# Altium project 15W_FlyBack_Converter.PrjPcb
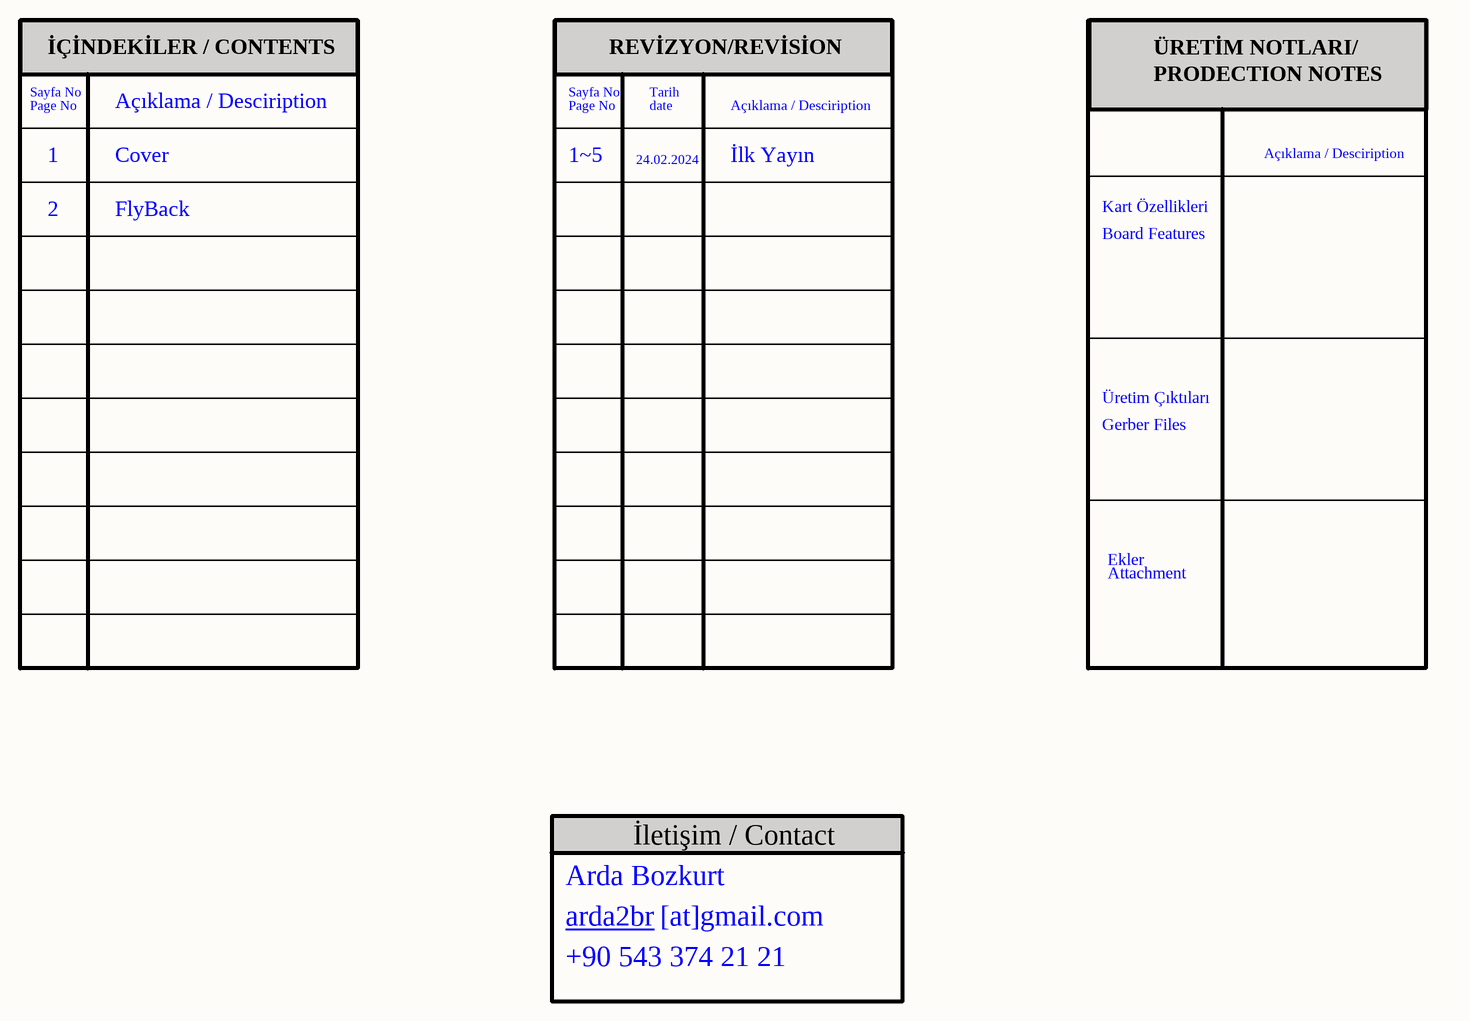
[diagram p0: Cover_Page.SchDoc]
2 sheets, 49 parts. Net scope: global (net labels, ports and power ports of the same name join across sheets).
Board file: 15WFlyBack.PcbDoc
Sheets:
  Cover_Page.SchDoc
  FlyBack.SchDoc

## Sheet Cover_Page.SchDoc
size 420 x 297 mm; Date: 24.02.2024; ApprovedBy: Arda B.; CheckedBy: Arda B.; CompanyName: -; DrawnBy: Arda Bozkurt; Revision: 001; SheetNumber: 1; SheetTotal: 2; Department: HDD; Size: A3

### Notes on the sheet
- İÇİNDEKİLER / CONTENTS
- REVİZYON/REVİSİON
- ÜRETİM NOTLARI/
- PRODECTION NOTES
- Page No
- Sayfa No
- Açıklama / Desciription
- date
- Tarih
- 1
- 2
- Cover
- FlyBack
- 1~5
- 24.02.2024
- İlk Yayın
- Kart Özellikleri
- Board Features
- Üretim Çıktıları
- Gerber Files
- Ekler
- Attachment
- Arda Bozkurt
- İletişim / Contact
- arda2br
- +90 543 374 21 21
- [at]gmail.com
- REVİSİON
- DESCRIPTION
- DATE
- APPROVED
- DWG NO:
- TAINIM/DESCRIPTION
- REV:
- DOSYA ADI/FİLE NAME
- HAZIRLAYAN/PREPARED BY
- KONTROL EDEN/ CHECKED BY
- YAYIN TARİHİ/REL. DATE
- DEĞ TARİHİ/CHANCE DATE
- ONAYLAYAN/APPROVED BY
- REVİZYON/REVISION
- BÖLÜM/DEPARTMENT
- BOYUT/SİZE
- SAYFA/SHEET
- of

## Sheet FlyBack.SchDoc
size 420 x 297 mm; Date: 24.02.2024; ApprovedBy: Arda B.; CheckedBy: Arda B.; DrawnBy: Arda Bozkrt; Revision: 001; SheetNumber: 2; SheetTotal: 2; Size: A3; Department: HDD; Time: 24.02.2024
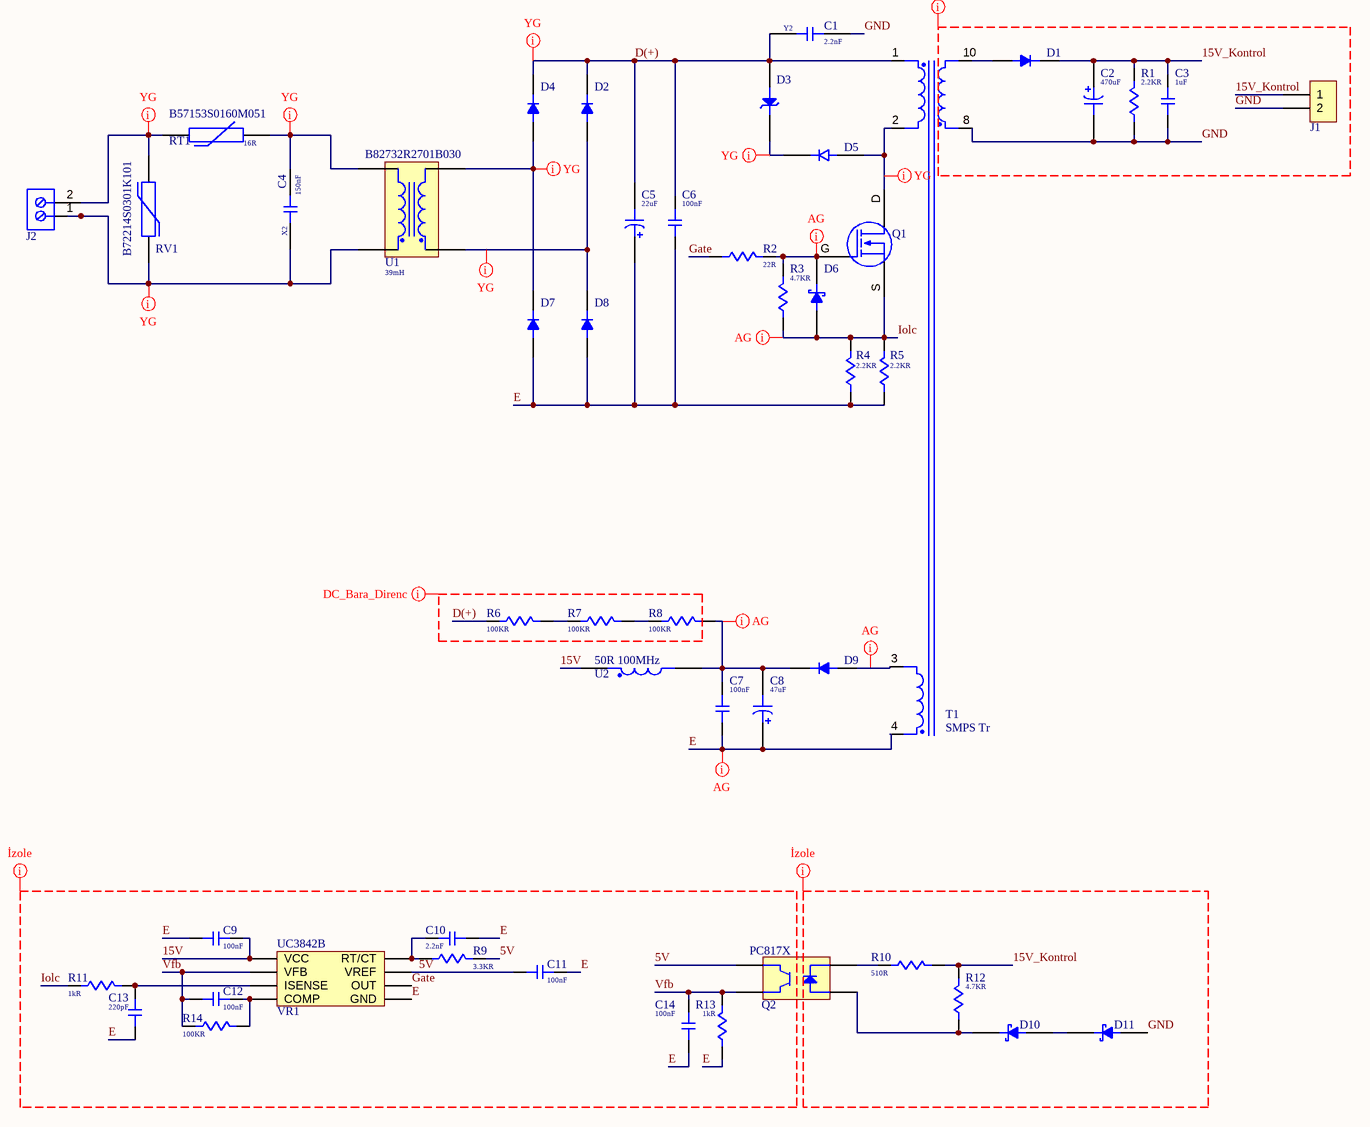
[diagram p1: FlyBack.SchDoc]

### Parts
C1  value 2.2nF  Parameter 1: Y2  [Y2-CAP]  (hidden comment: 495-4967-1-ND)
C2  value 470uF  [CAPPRD500W60D1025H1750]  (hidden comment: 860040475008)
C3  value 1uF  [CAP-0805]  (hidden comment: CL21B105KBFNNNE)
C4  value 150nF  Parameter 1: X2  [X2-CAP]  (hidden comment: MPX154K305E)
C5  value 22uF  [22uF 400V]  (hidden comment: C 22uF 400 270mArms)
C6  value 100nF  [CAP-1812]  (hidden comment: C1812C104KDRAC7800)
C7  value 100nF  [CAP-0603]  (hidden comment: CC0603KRX7R8BB104)
C8  value 47uF  [CAPPRD200W50D525H1250]  (hidden comment: 1189-1590-1-ND)
C9  value 100nF  [CAP-0603]  (hidden comment: CC0603KRX7R8BB104)
C10  value 2.2nF  [CAP-0603]  (hidden comment: KGM15AR71E222JT)
C11  value 100nF  [CAP-0603]  (hidden comment: CC0603KRX7R8BB104)
C12  value 100nF  [CAP-0603]  (hidden comment: CC0603KRX7R8BB104)
C13  value 220pF  [CAP-0603]  (hidden comment: KGM15ACG1E221JT)
C14  value 100nF  [CAP-0603]  (hidden comment: CC0603KRX7R8BB104)
D1  MUR460RLG  [DO-201AD-TO]  (value not drawn)
D2  1N4007FLTR  [DO-214AAC(SMB)]  (value not drawn)
D3  P6KE200  [TO-P6KE]  (value not drawn)
D4  1N4007FLTR  [DO-214AAC(SMB)]  (value not drawn)
D5  US1M  [DO-214AAC(SMB)]  (value not drawn)
D6  ZENER  [SOD-123]  (value not drawn)
D7  1N4007FLTR  [DO-214AAC(SMB)]  (value not drawn)
D8  1N4007FLTR  [DO-214AAC(SMB)]  (value not drawn)
D9  ES2D  [DO-214AAC(SMB)]  (value not drawn)
D10  ZENER  [SOD-123]  (value not drawn)
D11  ZENER  [SOD-123]  (value not drawn)
J1  691210910002  [CONN-TENMİNAL-BLOCK-DC]  (value not drawn)
J2  691214410002  [CONN-TERMİNAL-BLOCK-AC]  (value not drawn)
Q1  NTD360N80S3Z  [TO-252-MOSFET]  (value not drawn)
Q2  PC817X  [PC817-SMD]
R1  value 2.2KR  [RES-1206]  (hidden comment: RMCF1206JT2K20)
R2  value 22R  [RES-1206]  (hidden comment: RMCF1206JT22R0)
R3  value 4.7KR  [RES-1206]  (hidden comment: RC1206JR-074K7L)
R4  value 2.2KR  [RES-1206]  (hidden comment: RMCF1206JT2K20)
R5  value 2.2KR  [RES-1206]  (hidden comment: RMCF1206JT2K20)
R6  value 100KR  [RES-1206]  (hidden comment: RC1206JR-07100KL)
R7  value 100KR  [RES-1206]  (hidden comment: RC1206JR-07100KL)
R8  value 100KR  [RES-1206]  (hidden comment: RC1206JR-07100KL)
R9  value 3.3KR  [RES-1206]  (hidden comment: RC1206JR-073K3L)
R10  value 510R  [RES-1206]  (hidden comment: RMCF1206JT510R)
R11  value 1kR  [RES-0603]  (hidden comment: ESR03EZPJ102)
R12  value 4.7KR  [RES-1206]  (hidden comment: RC1206JR-074K7L)
R13  value 1kR  [RES-0603]  (hidden comment: ESR03EZPJ102)
R14  value 100KR  [RES-1206]  (hidden comment: RC1206JR-07100KL)
RT1  B57153S0160M051  value 16R  [NTC-TO]
RV1  B72214S0301K101  [VARİSTOR]
T1  SMPS Tr  [SMPS-TR3]
U1  B82732R2701B030  value 39mH  [CMC]
U2  50R 100MHz  [BEAD-1206]
VR1  UC3842B  [SOP-8-UC]

### Nets
5V: C11.1 Q2.3 R9.2 VR1.8(VREF)
15V: C9.2 U2.1 VR1.7(VCC)
15V_Kontrol: C2.2 C3.2 D1.2 J1.1 R1.2 R10.2 R12.2
D(+): C1.1 C5.1 C6.2 D2.2 D3.1 D4.2 R6.1 T1.1
E: C5.2 C6.1 C7.1 C8.2 C9.1 C10.2 C11.2 C13.1 C14.1 D7.1 D8.1 R4.1 R5.1 R13.1 T1.4 VR1.5(GND)
Gate: R2.1 VR1.6(OUT)
GND: C1.2 C2.1 C3.1 D11.1 J1.2 R1.1 T1.8
Iolc: D6.1 Q1.S R3.1 R4.2 R5.2 R11.1
Vfb: C12.1 C14.2 Q2.4 R13.2 R14.1 VR1.2(VFB)
NetC4_1: C4.1 J2.1 RV1.1 U1.2
NetC4_2: C4.2 RT1.2 U1.1
NetC7_2: C7.2 C8.1 D9.2 R8.2 U2.2
NetC10_1: C10.1 R9.1 VR1.4(RT/CT)
NetC12_2: C12.2 R14.2 VR1.1(COMP)
NetC13_2: C13.2 R11.2 VR1.3(ISENSE)
NetD1_1: D1.1 T1.10
NetD2_1: D2.1 D8.2 U1.3
NetD3_2: D3.2 D5.2
NetD4_1: D4.1 D7.2 U1.4
NetD5_1: D5.1 Q1.D T1.2
NetD6_2: D6.2 Q1.G R2.2 R3.2
NetD9_1: D9.1 T1.3
NetD10_1: D10.1 D11.2
NetD10_2: D10.2 Q2.1 R12.1
NetJ2_2: J2.2 RT1.1 RV1.2
NetQ2_2: Q2.2 R10.1
NetR6_2: R6.2 R7.1
NetR7_2: R7.2 R8.1

### Layout directives
net class AG: E, Iolc, NetC7_2, NetD6_2, NetD9_1
net class İzole: 5V, 15V, 15V_Kontrol, E, Gate, GND, Iolc, Vfb
net class DC_Bara_Direnc: D(+)
net class YG: D(+), NetC4_1, NetC4_2, NetD2_1, NetD3_2, NetD4_1, NetD5_1, NetJ2_2

### Notes on the sheet
- REVİSİON
- DESCRIPTION
- DATE
- APPROVED
- DWG NO:
- TAINIM/DESCRIPTION
- REV:
- DOSYA ADI/FİLE NAME
- HAZIRLAYAN/PREPARED BY
- KONTROL EDEN/ CHECKED BY
- YAYIN TARİHİ/REL. DATE
- DEĞ TARİHİ/CHANCE DATE
- ONAYLAYAN/APPROVED BY
- REVİZYON/REVISION
- Arda Bozkurt
- BÖLÜM/DEPARTMENT
- BOYUT/SİZE
- SAYFA/SHEET
- of

### Library data of the parts
C1 = Cap Y2 2.2nF 300V MKP TDK: Film Capacitor, Polypropylene, 1500V, 20% +Tol, 20% -Tol, 0.0022uF, Through Hole Mount; Manufacturer: TDK EPCOS; Manufacturer Part Number: B32021A3222M189; Supplier: Farnell; Supplier Part Number: 2525309; RoHS: Yes; Category: Film Capacitors; Stock: 6753; Pricing: 1=0,423, 50=0,366, 100=0,309, 250=0,282, 500=0,255 (EUR); Lead Free: 5697LeadFree; ComponentLink1URL: https://datasheet.ciiva.com/26855/getdatasheetpartid-407539-26855093.pdf?src-supplier=Verical; ComponentLink1Description: https://datasheet.ciiva.com/26855/getdatasheetpartid-407539-26855093.pdf?src-supplier=Verical; ComponentLink2URL: https://datasheet.ciiva.com/7614/y2-b32021-026-7614902.pdf?src-supplier=Digikey; ComponentLink2Description: https://datasheet.ciiva.com/7614/y2-b32021-026-7614902.pdf?src-supplier=Digikey
C2 = CAP 470uF 35V 1.76A 28mOhm: WCAP-ATUL Aluminum Electrolytic Capacitors; Manufacturer: Wurth Electronics; Supplier: Farnell; Supplier Part Number: 2495092; Manufacturer Part Number: 860040475008; RoHS: Yes; Category: Aluminum Electrolytic Capacitors; Stock: 471; Pricing: 1=0,614, 10=0,591, 50=0,456, 100=0,397, 200=0,353, 500=0,309, 2500=0,303, 5000=0,297 (EUR); ComponentLink1URL: http://www.farnell.com/datasheets/1958393.pdf?src-supplier=Farnell; ComponentLink1Description: http://www.farnell.com/datasheets/1958393.pdf?src-supplier=Farnell; ComponentLink2URL: http://www.produktinfo.conrad.com/datenblaetter/1200000-1299999/001281119-da-01-en-WCAP_ATUL_ALU_ELEC_CAPS_860040475008.pdf?src-supplier=Conrad; ComponentLink2Description: http://www.produktinfo.conrad.com/datenblaetter/1200000-1299999/001281119-da-01-en-WCAP_ATUL_ALU_ELEC_CAPS_860040475008.pdf?src-supplier=Conrad; ComponentLink3URL: http://katalog.we-online.de/pbs/datasheet/860040475008.pdf?src-supplier=Digikey; ComponentLink3Description: http://katalog.we-online.de/pbs/datasheet/860040475008.pdf?src-supplier=Digikey; ComponentLink4URL: https://katalog.we-online.de/pbs/datasheet/860040475008.pdf?src-supplier=Digikey; ComponentLink4Description: https://katalog.we-online.de/pbs/datasheet/860040475008.pdf?src-supplier=Digikey; ComponentLink5URL: http://www.farnell.com/datasheets/1958393.pdf?src-supplier=Element14; ComponentLink5Description: http://www.farnell.com/datasheets/1958393.pdf?src-supplier=Element14
C3 = C-CER 1uF 50V X7R 0805: Multilayer Ceramic Capacitor, 1 uF, 50 V, ± 10%, X7R, 0805 [2012 Metric]; Manufacturer: Samsung; Voltage Rating: 50V; Supplier: Farnell; Supplier Part Number: 3013482; Manufacturer Part Number: CL21B105KBFNNNE; RoHS: Yes; Category: Ceramic Capacitors; Stock: 143392; Pricing: 5=0,063, 50=0,038, 250=0,032, 500=0,027, 1000=0,021 (EUR); Mounting Technology: Surface Mount; Case/Package: 0805; Material: Ceramic; Case Code (Metric): 2012; Case Code (Imperial): 0805; Min Operating Temperature: -55°C; Max Operating Temperature: 125°C; Tolerance: 10%; Packaging: Tape and Reel; Package Quantity: 1; Dielectric: X7R; Voltage: 50V; Series: CL; Construction: Flat; Voltage Rating (DC): 50V; Length: 2mm; Width: 0.049inch; Height: 1.25mm; Thickness: 0.053inch; Depth: 1.25mm; Radiation Hardening: No; RoHS Compliant: Yes; ComponentLink1URL: https://datasheet.ciiva.com/25800/cl21b105kbfnnne-25800291.pdf?src-supplier=Digikey; ComponentLink1Description: https://datasheet.ciiva.com/25800/cl21b105kbfnnne-25800291.pdf?src-supplier=Digikey
C4 = CAP 150nF 305VAC X2: MPX Boxed Metalized Propylene X2 Class Interference Suppressor Film Capacitors; Manufacturer: Cornell Dubilier; Supplier: Mouser; Supplier Part Number: 598-MPX154K305E; Manufacturer Part Number: MPX154K305E; RoHS: No; Stock: 2208; Pricing: 1=0,55, 10=0,366, 50=0,366, 100=0,241, 1000=0,159, 10000=0,129 (USD); ComponentLink1URL: http://www.illinoiscapacitor.com/pdf/seriesDocuments/MPX%20series.pdf?src-supplier=Digikey; ComponentLink1Description: http://www.illinoiscapacitor.com/pdf/seriesDocuments/MPX%20series.pdf?src-supplier=Digikey
C5 = CAP 22uF 400V 270mArms: Cap Aluminum Lytic 22uF 400V 20%( 12.5 X 16mm) Radial 5mm 180mA 2000h 105C; Manufacturer: Rubycon; Manufacturer Part Number: 400AX22MEFC12.5X16; Supplier: Mouser; Supplier Part Number: 232-400AX22MEFC125X1; RoHS: Yes; Category: Aluminum Electrolytic Capacitors; Stock: 1061; Pricing: 1=1,01, 10=0,638, 50=0,638, 100=0,52, 1000=0,366, 10000=0,336 (USD); Mounting Technology: Through Hole; Case/Package: Radial; Min Operating Temperature: -40°C; Max Operating Temperature: 105°C; Voltage Rating: 400V; Tolerance: 20%; Series: AX; RoHS Compliant: Yes; ComponentLink1URL: http://www.rubycon.co.jp/en/catalog/e_pdfs/aluminum/Radial_Lead_Alumi_Eng.pdf?src-supplier=Digikey; ComponentLink1Description: http://www.rubycon.co.jp/en/catalog/e_pdfs/aluminum/Radial_Lead_Alumi_Eng.pdf?src-supplier=Digikey
C6 = C-CER 100nF 1KV X7R 1812: Multilayer Ceramic Capacitor, 0.1 uF, 1000 V, ± 10%, X7R, 1812 [4532 Metric]; Manufacturer: KEMET; Manufacturer Part Number: C1812C104KDRACTU; Material: 4241ConductorMaterial; Voltage Rating: 1kV; Supplier: Mouser; Supplier Part Number: 80-C1812C104KDRACTU; RoHS: Yes; Category: Ceramic Capacitors; Stock: 11645; Pricing: 1=0,71, 10=0,47, 50=0,47, 100=0,354, 1000=0,294, 10000=0,282 (USD); Mounting Technology: Surface Mount; Case/Package: 1812; Case Code (Imperial): 1812; Case Code (Metric): 4532; Dielectric Material: 4241ConductorMaterial; Min Operating Temperature: -55°C; Max Operating Temperature: 125°C; Packaging: Tape and Reel; Voltage Rating (DC): 1kV; Package Quantity: 1; Series: C; Tolerance: 10%; Dielectric: X7R; Termination: SMD/SMT; Length: 0.177inch; Width: 0.126inch; Height: 1.85mm; Thickness: 0.073inch; RoHS Compliant: Yes; Reach SVHC Compliant: No; ComponentLink1URL: http://www.farnell.com/datasheets/2746125.pdf?src-supplier=Farnell; ComponentLink1Description: http://www.farnell.com/datasheets/2746125.pdf?src-supplier=Farnell; ComponentLink2URL: http://www.mouser.com/ds/2/212/KEM_C1010_X7R_HV_SMD-1102742.pdf?src-supplier=Mouser; ComponentLink2Description: http://www.mouser.com/ds/2/212/KEM_C1010_X7R_HV_SMD-1102742.pdf?src-supplier=Mouser; ComponentLink3URL: https://datasheet.octopart.com/C1812C104KDRACTU-Kemet-datasheet-65933459.pdf?src-supplier=Element14; ComponentLink3Description: https://datasheet.octopart.com/C1812C104KDRACTU-Kemet-datasheet-65933459.pdf?src-supplier=Element14; ComponentLink4URL: https://datasheet.octopart.com/C1812C104KDRACTU-KEMET-datasheet-103257394.pdf?src-supplier=Farnell; ComponentLink4Description: https://datasheet.octopart.com/C1812C104KDRACTU-KEMET-datasheet-103257394.pdf?src-supplier=Farnell; ComponentLink5URL: https://datasheet.octopart.com/C1812C104KDRACTU-KEMET-datasheet-83562145.pdf?src-supplier=Newark; ComponentLink5Description: https://datasheet.octopart.com/C1812C104KDRACTU-KEMET-datasheet-83562145.pdf?src-supplier=Newark; ComponentLink6URL: https://api.kemet.com/component-edge/download/specsheet/C1812C104KDRAC7800.pdf?src-supplier=Digikey; ComponentLink6Description: https://api.kemet.com/component-edge/download/specsheet/C1812C104KDRAC7800.pdf?src-supplier=Digikey; ComponentLink7URL: https://search.kemet.com/component-edge/download/specsheet/C1812C104KDRAC7800.pdf?src-supplier=Digikey; ComponentLink7Description: https://search.kemet.com/component-edge/download/specsheet/C1812C104KDRAC7800.pdf?src-supplier=Digikey; ComponentLink8URL: http://www.farnell.com/datasheets/2746125.pdf?src-supplier=Newark; ComponentLink8Description: http://www.farnell.com/datasheets/2746125.pdf?src-supplier=Newark; ComponentLink9URL: https://datasheet.octopart.com/C1812C104KDRACTU-KEMET-datasheet-147336162.pdf?src-supplier=TME; ComponentLink9Description: https://datasheet.octopart.com/C1812C104KDRACTU-KEMET-datasheet-147336162.pdf?src-supplier=TME; ComponentLink10URL: https://datasheet.octopart.com/C1812C104KDRACTU-KEMET-datasheet-134136062.pdf?src-supplier=Electro+Sonic; ComponentLink10Description: https://datasheet.octopart.com/C1812C104KDRACTU-KEMET-datasheet-134136062.pdf?src-supplier=Electro+Sonic
C7 C9 C11 C12 C14 = C-CER 0.1UF 25V X7R 0603: Multilayer Ceramic Capacitor, 0.1 uF, 25 V, ± 10%, X7R, 0603 [1608 Metric]; Manufacturer: Yageo; Material: 4241ConductorMaterial; Voltage Rating: 25V; Supplier: Farnell; Supplier Part Number: 3369240; Manufacturer Part Number: CC0603KRX7R8BB104; RoHS: Yes; Category: Ceramic Capacitors; Stock: 1312755; Pricing: 10=0,026, 100=0,015, 500=0,012, 1000=0,01, 2000=0,0098 (EUR); Mounting Technology: Surface Mount; Case/Package: 0603; Pins: 2; Case Code (Imperial): 0603; Case Code (Metric): 1608; Min Operating Temperature: -55°C; Max Operating Temperature: 125°C; Tolerance: 10%; Dielectric: X7R; Packaging: Tape and Reel; Package Quantity: 1; Voltage Rating (DC): 25V; Termination: SMD/SMT; Voltage: 25V; Series: CC; Length: 1.6mm; Width: 0.031inch; Height: 0.8mm; Thickness: 0.035inch; Depth: 0.8mm; Radiation Hardening: No; RoHS Compliant: Yes; Reach SVHC Compliant: Unknown; Halogen Free: 5694HalogenFree; Lead Free: 5697LeadFree; ComponentLink1URL: https://datasheet.ciiva.com/144/mlccorderingcode-144075.pdf?src-supplier=Digikey; ComponentLink1Description: https://datasheet.ciiva.com/144/mlccorderingcode-144075.pdf?src-supplier=Digikey; ComponentLink2URL: https://datasheet.ciiva.com/11786/0900766b80c10176-11786120.pdf?src-supplier=Rs; ComponentLink2Description: https://datasheet.ciiva.com/11786/0900766b80c10176-11786120.pdf?src-supplier=Rs; ComponentLink3URL: https://datasheet.ciiva.com/13389/upy-gphc-x7r-6-3v-to-50v-8-13389352.pdf?src-supplier=Mouser; ComponentLink3Description: https://datasheet.ciiva.com/13389/upy-gphc-x7r-6-3v-to-50v-8-13389352.pdf?src-supplier=Mouser; ComponentLink4URL: https://datasheet.ciiva.com/7978/1489800-7978155.pdf?src-supplier=Element14; ComponentLink4Description: https://datasheet.ciiva.com/7978/1489800-7978155.pdf?src-supplier=Element14; ComponentLink5URL: https://datasheet.ciiva.com/28450/1489800-28450584.pdf?src-supplier=Element14; ComponentLink5Description: https://datasheet.ciiva.com/28450/1489800-28450584.pdf?src-supplier=Element14; ComponentLink6URL: https://datasheet.ciiva.com/144/mlccorderingcode-144074.pdf?src-supplier=Digikey; ComponentLink6Description: https://datasheet.ciiva.com/144/mlccorderingcode-144074.pdf?src-supplier=Digikey; ComponentLink7URL: https://datasheet.ciiva.com/144/mlccorderingcode-144073.pdf?src-supplier=Digikey; ComponentLink7Description: https://datasheet.ciiva.com/144/mlccorderingcode-144073.pdf?src-supplier=Digikey; ComponentLink8URL: https://datasheet.ciiva.com/11587/upy-gphc-x7r-6-3v-to-50v-8-11587208.pdf?src-supplier=Avnet; ComponentLink8Description: https://datasheet.ciiva.com/11587/upy-gphc-x7r-6-3v-to-50v-8-11587208.pdf?src-supplier=Avnet; ComponentLink9URL: https://datasheet.ciiva.com/26829/getdatasheetpartid-403577-26829431.pdf?src-supplier=Verical; ComponentLink9Description: https://datasheet.ciiva.com/26829/getdatasheetpartid-403577-26829431.pdf?src-supplier=Verical
C8 = CAP 47uF 25V 250mArms 400mOhm: RUBYCON         25YXJ47MTA5X11            Electrolytic Capacitor, Miniature, YXJ Series, 47 F,  20%, 25 V, 5 mm, Radial Leaded; Voltage Rating: 25V; Ripple Current: 175mA; Impedance: 400mR; Supplier: Farnell; Supplier Part Number: 2346258; Manufacturer: Rubycon; Manufacturer Part Number: 25YXJ47MTA5X11; RoHS: Yes; Category: Aluminum Electrolytic Capacitors; Stock: 3896; Pricing: 5=0,121, 50=0,079, 250=0,068, 500=0,063, 1500=0,059, 3000=0,053, 15000=0,052, 30000=0,051 (EUR); Mounting Technology: Through Hole; Case/Package: Radial; Min Operating Temperature: -40°C; Max Operating Temperature: 105°C; Tolerance: 20%; Package Quantity: 2000; Packaging: Cut Tape; Voltage Rating (DC): 25V; Features: General Purpose; Series: YXJ; Diameter: 5mm; Height: 11mm; Lead Pitch: 0.079inch; Height - Seated (Max): 0.492inch; Reach SVHC Compliant: No; RoHS Compliant: Yes; ComponentLink1URL: https://datasheet.ciiva.com/6328/e-yxj-6328843.pdf?src-supplier=Digikey; ComponentLink1Description: https://datasheet.ciiva.com/6328/e-yxj-6328843.pdf?src-supplier=Digikey; ComponentLink2URL: https://datasheet.ciiva.com/22732/1657883-22732557.pdf?src-supplier=Element14; ComponentLink2Description: https://datasheet.ciiva.com/22732/1657883-22732557.pdf?src-supplier=Element14
C10 = C-CER 2.2nF 25V X7R 0603: CAP CER 2200PF 25V X7R 0603; Manufacturer: Kyocera AVX; Supplier: Mouser; Supplier Part Number: 581-KGM15AR71E222JT; Manufacturer Part Number: KGM15AR71E222JT; RoHS: No; Stock: 15998; Pricing: 1=0,1, 10=0,039, 50=0,039, 100=0,019, 1000=0,012, 10000=0,01 (USD)
C13 = C-CER 220pF 25V C0G/NP0 0603: CAP CER 220PF 25V C0G/NP0 0603; Manufacturer: Kyocera AVX; Supplier: Digikey; Supplier Part Number: 478-KGM15ACG1E221JTCT-ND; Manufacturer Part Number: KGM15ACG1E221JT; RoHS: No; Stock: 129544; Pricing: 1=0,1, 10=0,04, 50=0,0228, 100=0,0177, 500=0,01334, 1000=0,01048 (USD)
D1 = Diyot DO-201AD Dik: VR=600V IF=4A Trr=75ns; Manufacturer: ON Semiconductor; Supplier: Arrow Electronics; Supplier Part Number: MUR460RLG; Manufacturer Part Number: MUR460RLG; RoHS: Yes; Category: Rectifier Diodes; Stock: 76500; Pricing: 1500=0,256, 3000=0,2262, 7500=0,2123, 10500=0,1948, 37500=0,191 (USD); ComponentLink1URL: https://datasheet.ciiva.com/8292/mur420-d-8292330.pdf?src-supplier=Avnet; ComponentLink1Description: https://datasheet.ciiva.com/8292/mur420-d-8292330.pdf?src-supplier=Avnet; ComponentLink2URL: https://datasheet.ciiva.com/8299/mur420-d-8299765.pdf?src-supplier=Avnet; ComponentLink2Description: https://datasheet.ciiva.com/8299/mur420-d-8299765.pdf?src-supplier=Avnet; ComponentLink3URL: https://datasheet.ciiva.com/22659/1708324-22659094.pdf?src-supplier=Element14; ComponentLink3Description: https://datasheet.ciiva.com/22659/1708324-22659094.pdf?src-supplier=Element14; ComponentLink4URL: https://datasheet.ciiva.com/916/mur420-d-916026.pdf?src-supplier=Digikey; ComponentLink4Description: https://datasheet.ciiva.com/916/mur420-d-916026.pdf?src-supplier=Digikey; ComponentLink5URL: https://datasheet.ciiva.com/916/mur420-d-916027.pdf?src-supplier=Digikey; ComponentLink5Description: https://datasheet.ciiva.com/916/mur420-d-916027.pdf?src-supplier=Digikey
D2 D4 D7 D8 = D 1N4007 DO-214AA(SMB): Standard Rectifier 1000V SOD-123; Manufacturer: SMC; Supplier: Future Electronics; Supplier Part Number: 8135663; Manufacturer Part Number: 1N4007FLTR; RoHS: No; Pricing: 3000=0,014, 12000=0,0134, 45000=0,0129, 120000=0,0125, 300000=0,0119 (USD)
D3 = TVS DO15 162V 600W UNIDIR: Diode TVS Single Bi-Directional 171V 600W 2-Pin DO-15 - Tape and Reel; Manufacturer: Taiwan Semiconductor; Manufacturer Part Number: P6KE200CA; Designed By: Arda B.; Max Breakdown Voltage: 210V; Forward Voltage: 1V; Max Forward Surge Current (Ifsm): 2.5A; Max Repetitive Reverse Voltage (Vrrm): 250V; Power Dissipation: 200mW; Reverse Recovery Time: 50ns; Supplier: Mouser; Supplier Part Number: 821-P6KE200CA; RoHS: Yes; Category: TVS Diodes; Stock: 2424; Pricing: 1=0,43, 10=0,354, 50=0,354, 100=0,222, 1000=0,14, 10000=0,109 (USD); Reach SVHC Compliant: 4186SVHC; ComponentLink1URL: http://uk.rs-online.com/webdocs/0dae/0900766b80dae633.pdf?src-supplier=Rs; ComponentLink1Description: http://uk.rs-online.com/webdocs/0dae/0900766b80dae633.pdf?src-supplier=Rs; ComponentLink2URL: http://datasheet.octopart.com/P6KE200CA-Taiwan-Semiconductor-datasheet-62315087.pdf?src-supplier=Verical; ComponentLink2Description: http://datasheet.octopart.com/P6KE200CA-Taiwan-Semiconductor-datasheet-62315087.pdf?src-supplier=Verical; ComponentLink3URL: http://datasheet.octopart.com/P6KE200CA-Taiwan-Semiconductor-datasheet-62315087.pdf?src-supplier=Digikey; ComponentLink3Description: http://datasheet.octopart.com/P6KE200CA-Taiwan-Semiconductor-datasheet-62315087.pdf?src-supplier=Digikey; ComponentLink4URL: http://datasheet.octopart.com/P6KE200CA-Taiwan-Semiconductor-datasheet-62315087.pdf?src-supplier=Mouser; ComponentLink4Description: http://datasheet.octopart.com/P6KE200CA-Taiwan-Semiconductor-datasheet-62315087.pdf?src-supplier=Mouser; ComponentLink5URL: http://datasheet.octopart.com/P6KE200CA-Taiwan-Semiconductor-datasheet-62315087.pdf?src-supplier=Arrow+Electronics; ComponentLink5Description: http://datasheet.octopart.com/P6KE200CA-Taiwan-Semiconductor-datasheet-62315087.pdf?src-supplier=Arrow+Electronics; ComponentLink6URL: http://datasheet.octopart.com/P6KE200CA-Taiwan-Semiconductor-datasheet-62315087.pdf?src-supplier=Avnet; ComponentLink6Description: http://datasheet.octopart.com/P6KE200CA-Taiwan-Semiconductor-datasheet-62315087.pdf?src-supplier=Avnet; ComponentLink7URL: http://datasheet.octopart.com/P6KE200CA-Taiwan-Semiconductor-datasheet-62315087.pdf?src-supplier=Farnell; ComponentLink7Description: http://datasheet.octopart.com/P6KE200CA-Taiwan-Semiconductor-datasheet-62315087.pdf?src-supplier=Farnell; ComponentLink8URL: http://docs-usa.electrocomponents.com/techlib:/itc_doclist_US.htm?stockno=6873857&src-supplier=Allied+Electronics; ComponentLink8Description: http://docs-usa.electrocomponents.com/techlib:/itc_doclist_US.htm?stockno=6873857&src-supplier=Allied+Electronics; ComponentLink9URL: http://datasheet.octopart.com/P6KE200CA-Taiwan-Semiconductor-datasheet-62315087.pdf?src-supplier=Rs; ComponentLink9Description: http://datasheet.octopart.com/P6KE200CA-Taiwan-Semiconductor-datasheet-62315087.pdf?src-supplier=Rs
D5 = D 1KV 1A DO214AC SMA: Diode Ultra Fast Recovery Rectifier 1K Volt 1A 2-Pin SMA Tape and Reel; Manufacturer: Diodes; Manufacturer Part Number: US1M-13-F; Designed By: Arda B.; Reverse Voltage: 1kV; Supplier: Future Electronics; Supplier Part Number: 7135234; RoHS: Yes; Category: Rectifier Diodes; Stock: 5935000; Pricing: 5000=0,0385, 15000=0,0371, 20000=0,0367, 50000=0,0356, 75000=0,0345 (USD); ComponentLink1URL: https://datasheet.ciiva.com/27052/1542696-27052440.pdf?src-supplier=Jameco; ComponentLink1Description: https://datasheet.ciiva.com/27052/1542696-27052440.pdf?src-supplier=Jameco; ComponentLink2URL: https://datasheet.ciiva.com/4454/ds16008-60440-4454096.pdf?src-supplier=Mouser; ComponentLink2Description: https://datasheet.ciiva.com/4454/ds16008-60440-4454096.pdf?src-supplier=Mouser; ComponentLink3URL: https://datasheet.ciiva.com/917/ds16008-917195.pdf?src-supplier=Digikey; ComponentLink3Description: https://datasheet.ciiva.com/917/ds16008-917195.pdf?src-supplier=Digikey; ComponentLink4URL: https://datasheet.ciiva.com/917/ds16008-917196.pdf?src-supplier=Digikey; ComponentLink4Description: https://datasheet.ciiva.com/917/ds16008-917196.pdf?src-supplier=Digikey; ComponentLink5URL: https://datasheet.ciiva.com/8301/ds16008-8301519.pdf?src-supplier=Avnet; ComponentLink5Description: https://datasheet.ciiva.com/8301/ds16008-8301519.pdf?src-supplier=Avnet; ComponentLink6URL: https://datasheet.ciiva.com/22695/1906610-22695853.pdf?src-supplier=Element14; ComponentLink6Description: https://datasheet.ciiva.com/22695/1906610-22695853.pdf?src-supplier=Element14; ComponentLink7URL: https://datasheet.ciiva.com/8303/ds16008-8303103.pdf?src-supplier=Avnet; ComponentLink7Description: https://datasheet.ciiva.com/8303/ds16008-8303103.pdf?src-supplier=Avnet
D6 D10 D11 = Zener SOD-123: SOD-123; Manufacturer: Murata; Manufacturer Part Number: GRM2165C2A822JA01D; Designed By: Arda B.; Supplier: Mouser; Supplier Part Number: 81-GRM2165C2A822JA1D; RoHS: Yes; Category: Ceramic Capacitors; Stock: 3147; Pricing: 1=0,17, 10=0,107, 50=0,107, 100=0,054, 1000=0,035, 10000=0,026 (USD)
D9 = D GEN PURP 200V 2A DO214AA: ES2DFSCT-ND; Manufacturer: Diodes; Manufacturer Part Number: ES2DA-13-F; Package Body Material: Plastic; Diode Element Material: SILICON; Forward Current: 2A; Max Reverse Current: 5uA; Max Surge Current: 50A; Forward Voltage: 920mV; Recovery Time: 25ns; Number of Elements: 1; Reverse Voltage (DC): 200V; Polarity: Standard; Natural Thermal Resistance: 20°C/W; Application(s): EFFICIENCY; Diode Type: RECTIFIER; Time @ Peak Reflow Temperature-Max (s): 5s; Diode Capacitance-Max: 25pF; Designed By: Arda B.; Value: 25pF; Supplier: Digikey; Supplier Part Number: ES2DA-FDICT-ND; RoHS: Yes; Category: Rectifier Diodes; Stock: 395285; Pricing: 1=0,49, 10=0,382, 100=0,2291, 500=0,2121, 1000=0,14423, 2000=0,13278 (USD); Mounting Technology: Surface Mount; Case/Package: SMA; Pins: 2; Weight: 0.002258oz; Package Shape: Rectangular; Terminal Finish: Tin; Min Operating Temperature: -55°C; Max Operating Temperature: 150°C; Packaging: Tape and Reel; Package Quantity: 5000; Average Rectified Current: 2A; Reverse Recovery Time: 25ns; Max Repetitive Reverse Voltage (Vrrm): 200V; Peak Non-Repetitive Surge Current: 50A; Termination: SMD/SMT; Voltage Rating (DC): 200V; Current Rating: 2A; Output Current: 2A; Max Reverse Voltage (DC): 200V; Series: -; JESD-30 Code: R-PDSO-C2; Terminal Form: C BEND; Terminal Position: DUAL; Number of Phases: 1; Surface Mount: Yes; Moisture Sensitivity Level: 1; Peak Reflow Temperature (Cel): 245°C; Reverse Recovery Time-Max: 25ns; Length: 4.6mm; Width: 2.92mm; Height: 2.1mm; Radiation Hardening: No; Lead Free: Lead Free; RoHS Compliant: Yes
J1 = TERM BLOCK 2P HORIZON 2.54MM PCB: Tb, Wire To Brd, R/A, 2Way, 18Awg Rohs Compliant: Yes |Wurth Elektronik 691210910002; Manufacturer: Wurth Electronics; Plating: Brass,Steel; Number of Positions Per Level: 2; Number of Levels: 1; Current: 6A; Voltage: 150V; Number of Contacts: 2NUMBER; Wire Gauge (Max): 30AWG; Designed By: Arda B.; Supplier: Mouser; Supplier Part Number: 710-691210910002; Manufacturer Part Number: 691210910002; RoHS: Yes; Category: Terminal Blocks; Stock: 14926; Pricing: 1=1,14, 10=1,04, 50=0,984, 100=0,905, 1000=0,748, 10000=0,747 (USD); Mounting Technology: Through Hole; Color: Green; Contact Plating: Brass,Tin; Housing Material: Nylon; Contact Material: 154ConductorMaterial; Min Operating Temperature: -40°C; Max Operating Temperature: 105°C; Series: WR-TBL Series 2109; Termination: Screw; Current Rating: 6A; Number of Rows: 1NUMBER; Voltage Rating: 150V; Height: 8.7mm; Wire Gauge (Min): 18AWG; RoHS Compliant: Yes; ComponentLink1URL: https://katalog.we-online.de/em/datasheet/6912109100xx.pdf?src-supplier=Digikey; ComponentLink1Description: https://katalog.we-online.de/em/datasheet/6912109100xx.pdf?src-supplier=Digikey
J2 = TERMINAL BLOCK 7.62MM HORIZONT: 7.62 Mm Terminal Block, Horizont; Manufacturer: Wurth Electronics; Designed By: Arda B.; Supplier: Mouser; Supplier Part Number: 710-691214410002; Manufacturer Part Number: 691214410002; RoHS: No; Category: Terminal Blocks; Stock: 496; Pricing: 1=1,27, 10=1,14, 50=1,05, 100=0,97, 1000=0,722, 10000=0,722 (USD); ComponentLink1URL: https://katalog.we-online.de/em/datasheet/6912144100xx.pdf?src-supplier=Digikey; ComponentLink1Description: https://katalog.we-online.de/em/datasheet/6912144100xx.pdf?src-supplier=Digikey
Q1 = MOSFET N-CH 800V 13A DPAK: MOSFET – Power, N-Channel, SUPERFET® III, 800 V, 13 A, 360 mΩ, DPAK; Manufacturer: ON Semiconductor; Designed By: Arda B.; Supplier: Farnell; Supplier Part Number: 3528500; Manufacturer Part Number: NTD360N80S3Z; RoHS: Yes; Category: MOSFETs; Stock: 1911; Pricing: 1=3, 10=2,1, 100=1,71, 500=1,62, 2500=1,54, 5000=1,45, 7500=1,36 (EUR)
Q2 = OPTOISOLATOR 5KV TRANS 4DIP: DIP-4 Viso=5000Vrms VF(typ)=1.2V IF=50mA Vo=80V; Manufacturer: Sharp; Manufacturer Part Number: PC817X3NSZ9F; Designed By: Arda B.; Supplier: Mouser; Supplier Part Number: 852-PC817X3NSZ9F; RoHS: No; Stock: 27271; Pricing: 1=0,36, 10=0,236, 50=0,236, 100=0,157, 1000=0,09, 10000=0,07 (USD)
R1 R4 R5 = RES 2.2K OHM 5% 1/4W 1206: Res Thick Film 1206 2.2K Ohm 5% 0.25W(1/4W) ±200ppm/C Pad SMD Automotive T/R; Manufacturer: Stackpole Electronics; Supplier: Mouser; Supplier Part Number: 708-RMCF1206JT2K20; Manufacturer Part Number: RMCF1206JT2K20; RoHS: Yes; Category: Chip SMD Resistors; Stock: 58901; Pricing: 1=0,1, 10=0,025, 50=0,025, 100=0,011, 1000=0,005, 10000=0,003 (USD); ComponentLink1URL: https://datasheet.ciiva.com/15193/getdatasheetpartid-362055-15193733.pdf?src-supplier=Verical; ComponentLink1Description: https://datasheet.ciiva.com/15193/getdatasheetpartid-362055-15193733.pdf?src-supplier=Verical
R2 = RES 22 OHM 5% 1/4W 1206: Res Thick Film 1206 22 Ohm 5% 0.25W(1/4W) ±200ppm/C Pad SMD Automotive T/R; Manufacturer: Stackpole Electronics; Supplier: Mouser; Supplier Part Number: 708-RMCF1206JT22R0; Manufacturer Part Number: RMCF1206JT22R0; RoHS: Yes; Category: Chip SMD Resistors; Stock: 14781; Pricing: 1=0,1, 10=0,022, 50=0,022, 100=0,012, 1000=0,007, 10000=0,004 (USD); ComponentLink1URL: https://www.verical.com/server-webapp/html/getDatasheet?partID=368660&src-supplier=Verical; ComponentLink1Description: https://www.verical.com/server-webapp/html/getDatasheet?partID=368660&src-supplier=Verical; ComponentLink2URL: http://components.arrow.com/part/dataview/44988449S7077347N1174?src-supplier=Arrow+Electronics; ComponentLink2Description: http://components.arrow.com/part/dataview/44988449S7077347N1174?src-supplier=Arrow+Electronics; ComponentLink3URL: https://www.seielect.com/catalog/sei-rmcf_rmcp.pdf?src-supplier=Digikey; ComponentLink3Description: https://www.seielect.com/catalog/sei-rmcf_rmcp.pdf?src-supplier=Digikey; ComponentLink4URL: https://www.seielect.com/catalog/SEI-Packaging.pdf?src-supplier=Digikey; ComponentLink4Description: https://www.seielect.com/catalog/SEI-Packaging.pdf?src-supplier=Digikey; ComponentLink5URL: https://datasheet.octopart.com/RMCF1206JT22R0-Stackpole-Electronics-datasheet-28504820.pdf?src-supplier=Future+Electronics; ComponentLink5Description: https://datasheet.octopart.com/RMCF1206JT22R0-Stackpole-Electronics-datasheet-28504820.pdf?src-supplier=Future+Electronics; ComponentLink6URL: https://www.seielect.com/catalog/SEI-RMCF_RMCP.pdf?src-supplier=Avnet; ComponentLink6Description: https://www.seielect.com/catalog/SEI-RMCF_RMCP.pdf?src-supplier=Avnet; ComponentLink7URL: http://www.seielect.com/catalog/sei-rmc.pdf?src-supplier=Future+Electronics; ComponentLink7Description: http://www.seielect.com/catalog/sei-rmc.pdf?src-supplier=Future+Electronics; ComponentLink8URL: https://datasheet.octopart.com/RMCF1206JT22R0-Stackpole-Electronics-datasheet-155966809.pdf?src-supplier=Master+Electronics; ComponentLink8Description: https://datasheet.octopart.com/RMCF1206JT22R0-Stackpole-Electronics-datasheet-155966809.pdf?src-supplier=Master+Electronics
R3 R12 = RES 4.7K OHM 5% 1/4W 1206: Res Thick Film 1206 4.7K Ohm 5% 1/4W |100ppm/|C SMD Paper T/R; Manufacturer: Yageo; Voltage Rating (AC): 200V; Supplier: Farnell; Supplier Part Number: 9240608; Manufacturer Part Number: RC1206JR-074K7L; RoHS: Yes; Category: Chip SMD Resistors; Stock: 8940; Pricing: 10=0,023, 100=0,014, 500=0,011, 1000=0,009, 2500=0,0088 (EUR); ComponentLink1URL: https://datasheet.ciiva.com/2458/pyu-r-int-thick-7-2458638.pdf?src-supplier=Digikey; ComponentLink1Description: https://datasheet.ciiva.com/2458/pyu-r-int-thick-7-2458638.pdf?src-supplier=Digikey; ComponentLink2URL: https://datasheet.ciiva.com/2458/pyu-r-int-thick-7-2458639.pdf?src-supplier=Digikey; ComponentLink2Description: https://datasheet.ciiva.com/2458/pyu-r-int-thick-7-2458639.pdf?src-supplier=Digikey; ComponentLink3URL: https://datasheet.ciiva.com/2458/pyu-r-int-thick-7-2458640.pdf?src-supplier=Digikey; ComponentLink3Description: https://datasheet.ciiva.com/2458/pyu-r-int-thick-7-2458640.pdf?src-supplier=Digikey; ComponentLink4URL: https://datasheet.ciiva.com/7857/444357-7857511.pdf?src-supplier=Element14; ComponentLink4Description: https://datasheet.ciiva.com/7857/444357-7857511.pdf?src-supplier=Element14; ComponentLink5URL: https://datasheet.ciiva.com/7857/444357-7857512.pdf?src-supplier=Element14; ComponentLink5Description: https://datasheet.ciiva.com/7857/444357-7857512.pdf?src-supplier=Element14
R6-R8 R14 = RES 100K OHM 5% 1/4W 1206: SMD Chip Resistor, 100 kOhm, ± 5%, 250 mW, 1206 [3216 Metric], Thick Film, General Purpose; Manufacturer: Yageo; Voltage Rating (AC): 200V; Supplier: Digikey; Supplier Part Number: 311-100KERCT-ND; Manufacturer Part Number: RC1206JR-07100KL; RoHS: Yes; Category: Chip SMD Resistors; Stock: 265648; Pricing: 1=0,1, 10=0,035, 50=0,0226, 100=0,0189, 500=0,0131, 1000=0,01133 (USD); ComponentLink1URL: https://datasheet.ciiva.com/2458/pyu-rc1206-51-rohs-l-4-2458650.pdf?src-supplier=Digikey; ComponentLink1Description: https://datasheet.ciiva.com/2458/pyu-rc1206-51-rohs-l-4-2458650.pdf?src-supplier=Digikey; ComponentLink2URL: https://datasheet.ciiva.com/7857/444357-7857423.pdf?src-supplier=Element14; ComponentLink2Description: https://datasheet.ciiva.com/7857/444357-7857423.pdf?src-supplier=Element14; ComponentLink3URL: https://datasheet.ciiva.com/2458/pyu-rc1206-51-rohs-l-4-2458651.pdf?src-supplier=Digikey; ComponentLink3Description: https://datasheet.ciiva.com/2458/pyu-rc1206-51-rohs-l-4-2458651.pdf?src-supplier=Digikey; ComponentLink4URL: https://datasheet.ciiva.com/2458/pyu-rc1206-51-rohs-l-4-2458652.pdf?src-supplier=Digikey; ComponentLink4Description: https://datasheet.ciiva.com/2458/pyu-rc1206-51-rohs-l-4-2458652.pdf?src-supplier=Digikey
R9 = RES 3.3K OHM 5% 1/4W 1206: Res Thick Film 1206 3.3K Ohm 5% 0.25W(1/4W) ±100ppm/°C Pad SMD T/R; Manufacturer: Yageo; Supplier: Farnell; Supplier Part Number: 9240586; Manufacturer Part Number: RC1206JR-073K3L; RoHS: Yes; Category: Chip SMD Resistors; Stock: 162725; Pricing: 10=0,023, 100=0,014, 500=0,011, 1000=0,009, 2500=0,007, 5000=0,005, 25000=0,004, 50000=0,0039 (EUR); ComponentLink1URL: https://datasheet.ciiva.com/29181/402605-da-01-en-smd-widerstand-chip1206-3-3-kohm-29181477.pdf?src-supplier=Conrad; ComponentLink1Description: https://datasheet.ciiva.com/29181/402605-da-01-en-smd-widerstand-chip1206-3-3-kohm-29181477.pdf?src-supplier=Conrad; ComponentLink2URL: https://datasheet.ciiva.com/2458/pyu-r-int-thick-7-2458662.pdf?src-supplier=Digikey; ComponentLink2Description: https://datasheet.ciiva.com/2458/pyu-r-int-thick-7-2458662.pdf?src-supplier=Digikey; ComponentLink3URL: https://datasheet.ciiva.com/2458/pyu-r-int-thick-7-2458663.pdf?src-supplier=Digikey; ComponentLink3Description: https://datasheet.ciiva.com/2458/pyu-r-int-thick-7-2458663.pdf?src-supplier=Digikey; ComponentLink4URL: https://datasheet.ciiva.com/2458/pyu-r-int-thick-7-2458664.pdf?src-supplier=Digikey; ComponentLink4Description: https://datasheet.ciiva.com/2458/pyu-r-int-thick-7-2458664.pdf?src-supplier=Digikey
R10 = RES 510 OHM 5% 1/4W 1206: Res Thick Film 1206 510 Ohm 5% 0.25W(1/4W) ±200ppm/C Pad SMD Automotive T/R; Manufacturer: Stackpole Electronics; Supplier: Arrow Electronics; Supplier Part Number: RMCF1206JT510R; Manufacturer Part Number: RMCF1206JT510R; RoHS: Yes; Category: Chip SMD Resistors; Stock: 501; Pricing: 1=0,0711, 10=0,0194, 25=0,0132, 100=0,0103, 250=0,0102, 500=0,0061 (USD); ComponentLink1URL: https://www.seielect.com/Catalog/SEI-RMCF_RMCP.pdf?src-supplier=Avnet; ComponentLink1Description: https://www.seielect.com/Catalog/SEI-RMCF_RMCP.pdf?src-supplier=Avnet; ComponentLink2URL: https://www.seielect.com/catalog/sei-rmcf_rmcp.pdf?src-supplier=Digikey; ComponentLink2Description: https://www.seielect.com/catalog/sei-rmcf_rmcp.pdf?src-supplier=Digikey; ComponentLink3URL: https://www.seielect.com/catalog/SEI-Packaging.pdf?src-supplier=Digikey; ComponentLink3Description: https://www.seielect.com/catalog/SEI-Packaging.pdf?src-supplier=Digikey; ComponentLink4URL: https://datasheet.octopart.com/RMCF1206JT510R-Stackpole-Electronics-datasheet-28504820.pdf?src-supplier=Future+Electronics; ComponentLink4Description: https://datasheet.octopart.com/RMCF1206JT510R-Stackpole-Electronics-datasheet-28504820.pdf?src-supplier=Future+Electronics; ComponentLink5URL: https://datasheet.octopart.com/RMCF1206JT510R-Stackpole-Electronics-datasheet-11546843.pdf?src-supplier=Arrow+Electronics; ComponentLink5Description: https://datasheet.octopart.com/RMCF1206JT510R-Stackpole-Electronics-datasheet-11546843.pdf?src-supplier=Arrow+Electronics
R11 R13 = RES 1K OHM 5% 1/4W 0603: Res Thick Film 0603 1K Ohm 5% 0.25W(1/4W) ±200ppm/C Molded SMD Automotive Paper T/R; Manufacturer: Rohm; Temperature Coefficient: 200ppm/°C; Max Power Dissipation: 250mW; Voltage Rating: 150V; Supplier: Mouser; Supplier Part Number: 755-ESR03EZPJ102; Manufacturer Part Number: ESR03EZPJ102; RoHS: Yes; Category: Chip SMD Resistors; Stock: 869548; Pricing: 1=0,13, 10=0,044, 50=0,044, 100=0,026, 1000=0,021, 10000=0,014 (USD); Case/Package: 0603; Case Code (Metric): 1608; Case Code (Imperial): 0603; Min Operating Temperature: -55°C; Max Operating Temperature: 155°C; Tolerance: 5%; Packaging: Cut Tape; Number of Terminations: 2; Features: Automotive AEC-Q200; Series: ESR; Voltage Rating (DC): 150V; Ratings: AEC-Q200; Lead Free: Lead Free; RoHS Compliant: Yes; ComponentLink1URL: https://datasheet.ciiva.com/2469/esr-2469604.pdf?src-supplier=Digikey; ComponentLink1Description: https://datasheet.ciiva.com/2469/esr-2469604.pdf?src-supplier=Digikey; ComponentLink2URL: https://datasheet.ciiva.com/2469/esr-2469605.pdf?src-supplier=Digikey; ComponentLink2Description: https://datasheet.ciiva.com/2469/esr-2469605.pdf?src-supplier=Digikey; ComponentLink3URL: https://datasheet.ciiva.com/2469/esr-2469603.pdf?src-supplier=Digikey; ComponentLink3Description: https://datasheet.ciiva.com/2469/esr-2469603.pdf?src-supplier=Digikey
RT1 = NTC: Icl 16 Ohm 20% 8.5MM; Manufacturer: TDK EPCOS; Current Rating: 1.7A; Power Rating: 1.4W; Dissipation Factor: 8%; Lead Diameter: 0.6mm; Designed By: Arda B.; Supplier: Digikey; Supplier Part Number: B57153S0160M051-ND; Manufacturer Part Number: B57153S0160M051; RoHS: Yes; Pricing: 3000=0,31856 (USD); Case/Package: Radial; Min Operating Temperature: -55°C; Max Operating Temperature: 170°C; Package Quantity: 1500; Packaging: Tape and Reel; Tolerance: 20%; Series: S153; Diameter: 8.5mm; Width: 6mm; Lead Pitch: 5mm; RoHS Compliant: Yes; ComponentLink1URL: http://www.mouser.com/ds/2/400/NTC_ICL_S153-525550.pdf?src-supplier=Mouser; ComponentLink1Description: http://www.mouser.com/ds/2/400/NTC_ICL_S153-525550.pdf?src-supplier=Mouser
RV1 = VARISTOR 470V 4.5KA DISC 14MM: Epcos Standard Series Disc Varistor 300pF 4500A; Varistor 470V; Manufacturer: TDK EPCOS; Designed By: Arda B.; Supplier: Mouser; Supplier Part Number: 871-B72214S301K101; Manufacturer Part Number: B72214S0301K101; RoHS: Yes; Category: Varistors; Stock: 22154; Pricing: 1=0,4, 10=0,318, 50=0,318, 100=0,318, 1000=0,197, 10000=0,197 (USD); ComponentLink1URL: https://datasheet.ciiva.com/1278/1640466-1278043.pdf?src-supplier=Element14; ComponentLink1Description: https://datasheet.ciiva.com/1278/1640466-1278043.pdf?src-supplier=Element14
T1 = SMPS Tr EF25
U1 = CMC 39MH 700MA 2LN TH: Common Mode Chokes Dual 39mH 10kHz 700mA Thru-Hole Box; Manufacturer: TDK EPCOS; Core Material: Ferrite; Inductance Tolerance: -30%; Tolerance: 50%; Number of Lines: 2; Voltage Rating (AC): 250V; Designed By: Arda B.; Supplier: Digikey; Supplier Part Number: 495-2781-ND; Manufacturer Part Number: B82732R2701B030; RoHS: Yes; Category: Uncategorized; Stock: 1297; Pricing: 1=2,91, 10=2,475, 25=2,2812, 40=2,0385, 80=1,69875, 230=1,65017, 640=1,55309, 1280=1,45602, 2560=1,40749 (USD); Mounting Technology: Through Hole; Pins: 4; Weight: 0.35274oz; Min Operating Temperature: -40°C; Max Operating Temperature: 125°C; Current Rating: 700mA; Packaging: Tray; Package Quantity: 640; Max DC Current: 700mA; Termination: Radial; Series: B82732; Max Current Rating: 700mA; Orientation: 5495OrientationType; Length: 24mm; Width: 16.5mm; Height: 23mm; Reach SVHC Compliant: No; RoHS Compliant: Yes; ComponentLink1URL: https://datasheet.ciiva.com/4956/b82732r-w-58440-4956336.pdf?src-supplier=Mouser; ComponentLink1Description: https://datasheet.ciiva.com/4956/b82732r-w-58440-4956336.pdf?src-supplier=Mouser
U2 = Bead 1206: SMD 1206
VR1 = AC-DC CONTROLLERS & REGULA: Converter Offline Flyback Topology Up to 500kHz 8-SOIC; Manufacturer: ON Semiconductor; Manufacturer Part Number: UC3842BD1R2G; Designed By: Arda B.; Supplier: Digikey; Supplier Part Number: UC3842BD1R2GOSTR-ND; RoHS: Yes; Category: Voltage Regulators - Switching; Stock: 7500; Pricing: 2500=0,2367, 5000=0,22794, 12500=0,21917, 25000=0,217 (USD); ComponentLink1URL: https://datasheet.ciiva.com/2015/uc3842b-2015296.pdf?src-supplier=Digikey; ComponentLink1Description: https://datasheet.ciiva.com/2015/uc3842b-2015296.pdf?src-supplier=Digikey; ComponentLink2URL: https://datasheet.ciiva.com/2015/uc3842b-2015295.pdf?src-supplier=Digikey; ComponentLink2Description: https://datasheet.ciiva.com/2015/uc3842b-2015295.pdf?src-supplier=Digikey; ComponentLink3URL: https://datasheet.ciiva.com/2015/uc3842b-2015297.pdf?src-supplier=Digikey; ComponentLink3Description: https://datasheet.ciiva.com/2015/uc3842b-2015297.pdf?src-supplier=Digikey; ComponentLink4URL: https://datasheet.ciiva.com/4876/uc3842b-d-116980-4876037.pdf?src-supplier=Mouser; ComponentLink4Description: https://datasheet.ciiva.com/4876/uc3842b-d-116980-4876037.pdf?src-supplier=Mouser; ComponentLink5URL: https://datasheet.ciiva.com/8198/uc3842b-d-8198310.pdf?src-supplier=Avnet; ComponentLink5Description: https://datasheet.ciiva.com/8198/uc3842b-d-8198310.pdf?src-supplier=Avnet